# Altium schematic sheet USB.SchDoc
size A4; SheetNumber: 8; SheetTotal: 10
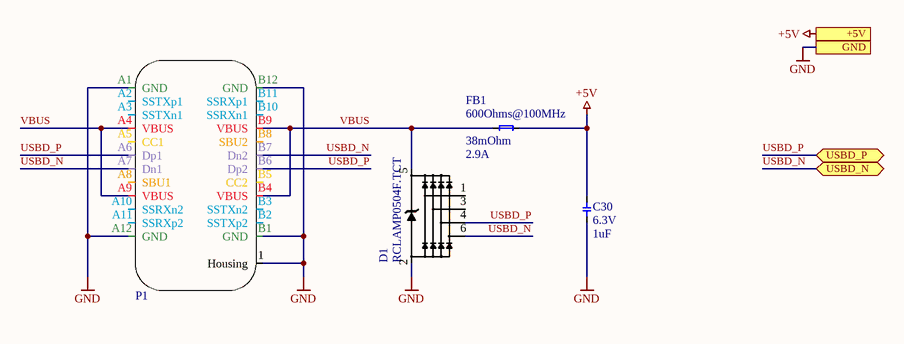
[diagram p0: USB.SchDoc]

## Parts
C30  value 1uF  Value2: 6.3V  [CX7R0603K]  (hidden comment: 06036C105JAT2A)
D1  RCLAMP0504F.TCT  [SOT23-6L_0.65_C]
FB1  DCR: 38mOhm  Current: 2.9A  Impedance: 600Ohms@100MHz  [BLM31KN_SN_1206_C]  (hidden comment: BLM31KN601SN1L)
P1  10132328-10011LF  [USB_TYPEC_VERTICAL_10132328-10011LF]  (value not drawn)

## Ports
+5V, GND, USBD_N (bidir), USBD_P (bidir)

## Nets
+5V: C30.2 FB1.2 ; port +5V
GND: C30.1 D1.2 P1.1(Housing) P1.A1(GND) P1.A12(GND) P1.B1(GND) P1.B12(GND) ; port GND
USBD_N: D1.6 P1.A7(Dn1) P1.B7(Dn2) ; port USBD_N
USBD_P: D1.4 P1.A6(Dp1) P1.B6(Dp2) ; port USBD_P
VBUS: D1.5 FB1.1 P1.A4(VBUS) P1.A9(VBUS) P1.B4(VBUS) P1.B9(VBUS)

Not connected (* = marked no-connect by the designer): D1 1 3; P1 A2(SSTXp1) A3(SSTXn1) A5(CC1) A8(SBU1) A10(SSRXn2) A11(SSRXp2) B2(SSTXp2) B3(SSTXn2) B5(CC2) B8(SBU2) B10(SSRXn1) B11(SSRXp1)

## Library data of the parts
C30 = kyocera-C-X7R-0603: SMD Capacitor; Dielectric: C; ToleranceCode: J; MaxThicknessCode: K; VoltageCode: 6; CapacitanceCode: 105; Size: 0603
D1 = RCLAMP0504F.TCT: 23V Clamp 6A (8/20µs) Ipp Tvs Diode Surface Mount SC-70-6; Type: RCLAMP0504F.TCT; Supplier 1: Digi-Key; Supplier Part Number 1: RCLAMP0504FCT-ND
FB1 = BLM31KN601SN1L: 600 Ohms @ 100 MHz 1 Power Line Ferrite Bead 1206 (3216 Metric) 2.9A 38mOhm; Type: BLM31KN601SN1L
P1 = 10132328-10011LF: USB-C (USB TYPE-C) USB 3.2 Gen 2 (USB 3.1 Gen 2, Superspeed + (USB 3.1)) Receptacle Connector 24 Position Surface Mount, Through Hole; Supplier 1: Digi-Key; Type: 10132328-10011LF; Supplier Part Number 1: 609-5380-1-ND